# EasyEDA schematic schematic.json
TITLE: Sheet_1; REV: 1.0; Date: 2024-03-19; Sheet: 1/1; Drawn By: znegin20; Company: Your Company
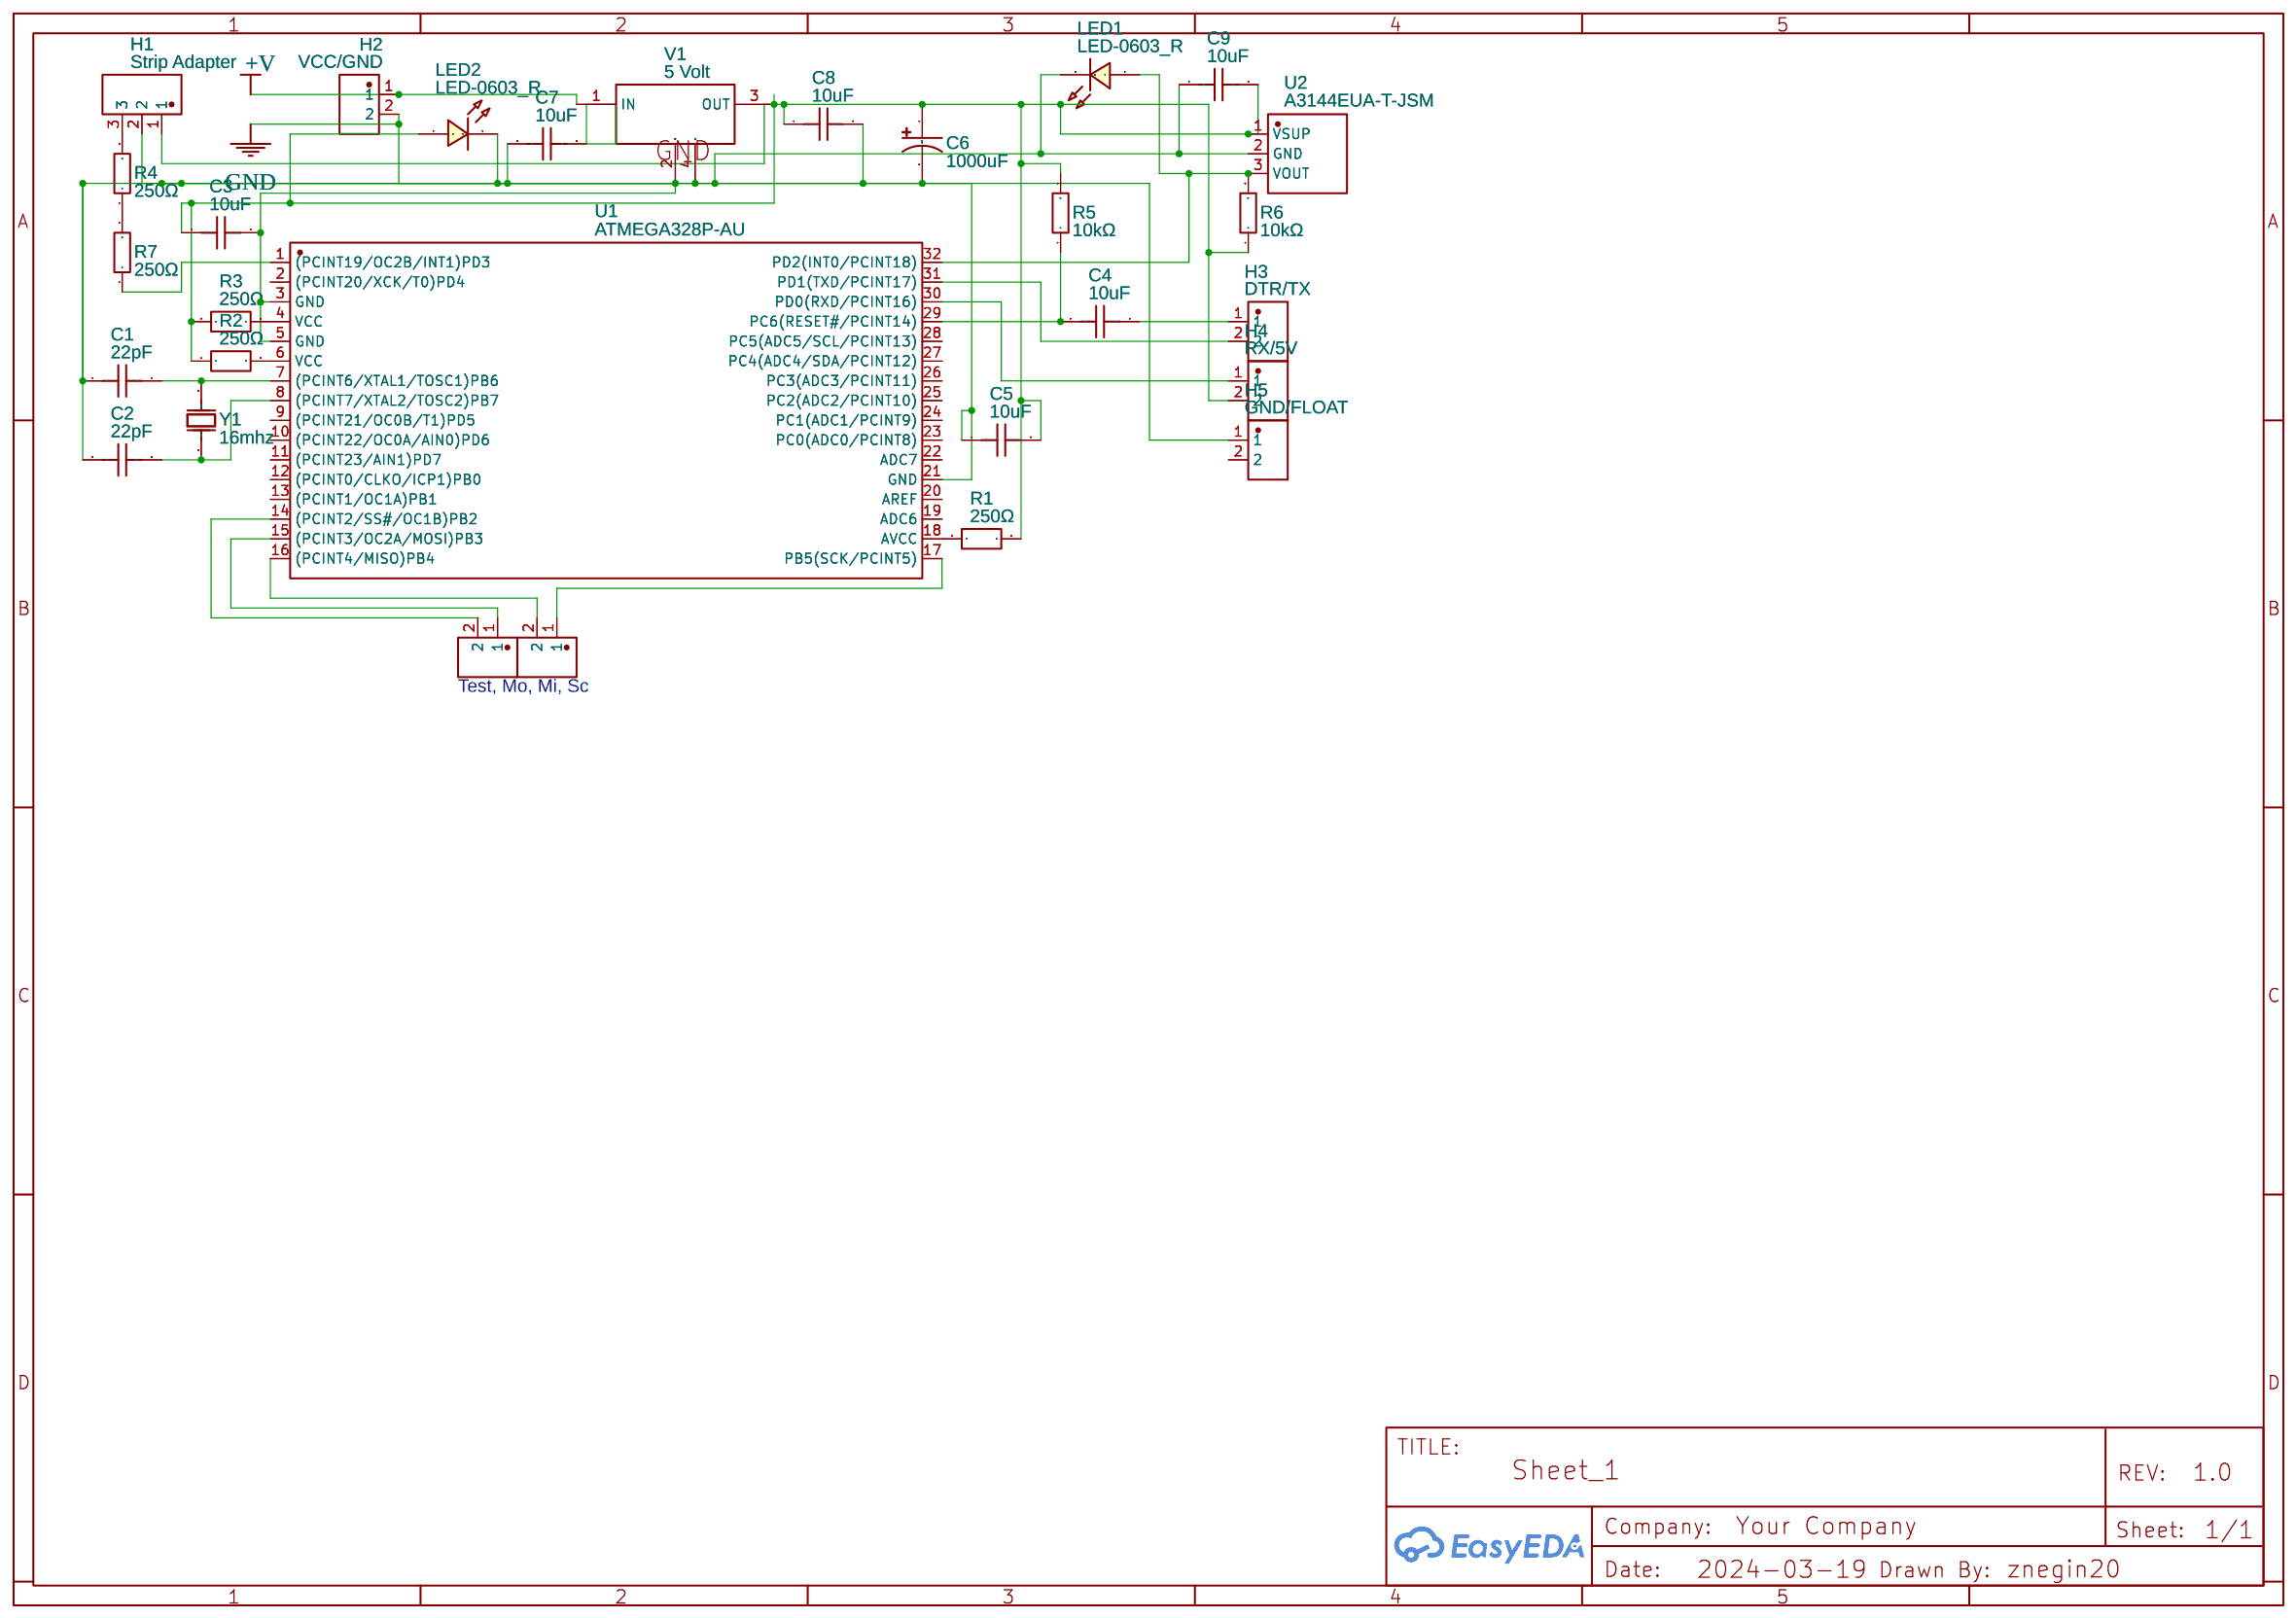
[diagram p0: schematic sheet]

## Parts
C1  22pF  [C0402]
C2  22pF  [C0402]
C3  10uF  [C0603]
C4  10uF  [C0603]
C5  10uF  [C0603]
C6  1000uF  [CAP-SMD_BD10.0-L10.3-W10.3-LS11.3-FD]
C7  10uF  [C0603]
C8  10uF  [C0603]
C9  10uF  [C0603]
H1  Strip Adapter  [HDR-TH_3P-P2.54_CS-1165SDIG]
H2  VCC/GND  [HDR-TH_2P-P2.00-H-F-W5.6-N]
H3  DTR/TX  [HDR-TH_2P-P2.00-H-F-W5.6-N]
H4  RX/5V  [HDR-TH_2P-P2.00-H-F-W5.6-N]
H5  GND/FLOAT  [HDR-TH_2P-P2.00-H-F-W5.6-N]
H7  GND/FLOAT  [HDR-TH_2P-P2.00-H-F-W5.6-N]
H8  GND/FLOAT  [HDR-TH_2P-P2.00-H-F-W5.6-N]
LED1  LED-0603_R  [LED0603_RED]
LED2  LED-0603_R  [LED0603_RED]
R1  250Ω  [R0603]
R2  250Ω  [R0603]
R3  250Ω  [R0603]
R4  250Ω  [R0402]
R5  10kΩ  [R0603]
R6  10kΩ  [R0603]
R7  250Ω  [R0402]
U1  ATMEGA328P-AU  [TQFP-32_L7.0-W7.0-P0.80-LS9.0-BL]
U2  A3144EUA-T-JSM  [TO-92S-3_L4.1-W1.7-P1.27-L]
V1  5 Volt  [TO-263-3_L10.2-W8.6-P2.54-LS14.4-TL]
Y1  16mhz  [HC-49S_L11.4-W4.5-LS12.7]

## Library data of the parts
C1 C2 = CL05C220JB5NNNC: Supplier: LCSC; Manufacturer: SAMSUNG(三星); Supplier Part: C70464; JLCPCB Part Class: Extended Part
C3-C5 C7-C9 = CL10A106MA8NRNC: Supplier: LCSC; Manufacturer: SAMSUNG(三星); Supplier Part: C96446; JLCPCB Part Class: Basic Part
C6 = VT1C102M1010: Contributor: LCSC; Supplier: LCSC; Supplier Part: C310843; Manufacturer: ROQANG(容强); JLCPCB Part Class: Extended Part
H1 = CS-1165SDIG-1*3: Contributor: LCSC; Supplier: LCSC; Supplier Part: C2886705; Manufacturer: CST(永丰盈); JLCPCB Part Class: Extended Part
H2-H5 H7 H8 = PM200-1-02-W-4.3: Contributor: LCSC; Supplier: LCSC; Supplier Part: C2906051; Manufacturer: HCTL(华灿天禄); JLCPCB Part Class: Extended Part
LED1 LED2 = LED-0603_R: Manufacturer: EVERLIGHT(台湾亿光); Manufacturer Part: 19-217/R6C-AL1M2VY/3T; Supplier Part: C72044; Supplier: LCSC; Contributor: LCEDA_01
R1-R3 = ARG03DTC2500: Contributor: lcsc; Supplier: LCSC; Supplier Part: C2828652; Manufacturer: Viking(光颉); JLCPCB Part Class: Extended Part
R4 R7 = ARG02FTC4700: Contributor: LCSC; Supplier: LCSC; Supplier Part: C284584; Manufacturer: Viking(光颉); JLCPCB Part Class: Extended Part
R5 R6 = AR03BTDX1002: Contributor: LCSC; Supplier: LCSC; Supplier Part: C319938; Manufacturer: Viking(光颉); JLCPCB Part Class: Extended Part
U1 = ATMEGA328P-AU COPY: Supplier: LCSC; Manufacturer: MICROCHIP(美国微芯); Supplier Part: C14877; JLCPCB Part Class: Extended Part
U2 = A3144EUA-T-JSM: Supplier: LCSC; Supplier Part: C18188954; Manufacturer: JSMSEMI(杰盛微); JLCPCB Part Class: Extended Part; Contributor: lcsc
V1 = LM7805SX/NOPB: Contributor: LCSC; Supplier: LCSC; Supplier Part: C2863046; Manufacturer: TI(德州仪器); JLCPCB Part Class: Extended Part
Y1 = HY16M49SSMDOB1R20: Contributor: lcsc; Supplier: LCSC; Supplier Part: C5265787; Manufacturer: Huiyuan crystal(惠源晶工)

## Nets
GND: C1.1 C2.1 C3.2 C5.1 C6.2 C7.1 C8.2 C9.1 H1.2 H2.2 H5.1 LED1.2 LED2.2 U1.3(GND) U1.5(GND) U1.21(GND) U2.2(GND) V1.2(GND) V1.4(GND)
+V: H2.1 V1.1(IN)
Net-(C1-2): C1.2 U1.7((PCINT6/XTAL1/TOSC1)PB6) Y1.2(OSC2)
Net-(C2-2): C2.2 U1.8((PCINT7/XTAL2/TOSC2)PB7) Y1.1(OSC1)
Net-(C3-1): C3.1 C5.2 C6.1 C8.1 C9.2 H1.1 H4.2 LED2.1 R1.2 R2.1 R3.1 R5.2 R6.1 U2.1(VSUP) V1.3(OUT)
Net-(C4-1): C4.1 R5.1 U1.29(PC6(RESET#/PCINT14))
Net-(C4-2): C4.2 H3.1
Net-(H1-3): H1.3 R4.2
Net-(H3-2): H3.2 U1.31(PD1(TXD/PCINT17))
Net-(H4-1): H4.1 U1.30(PD0(RXD/PCINT16))
Net-(H7-1): H7.1 U1.17(PB5(SCK/PCINT5))
Net-(H7-2): H7.2 U1.16((PCINT4/MISO)PB4)
Net-(H8-1): H8.1 U1.15((PCINT3/OC2A/MOSI)PB3)
Net-(H8-2): H8.2 U1.14((PCINT2/SS#/OC1B)PB2)
Net-(LED1-1): LED1.1 R6.2 U1.32(PD2(INT0/PCINT18)) U2.3(VOUT)
Net-(R1-1): R1.1 U1.18(AVCC)
Net-(R2-2): R2.2 U1.6(VCC)
Net-(R3-2): R3.2 U1.4(VCC)
Net-(R4-1): R4.1 R7.2
Net-(R7-1): R7.1 U1.1((PCINT19/OC2B/INT1)PD3)

Not connected (* = marked no-connect by the designer): C7 2; H5 2; U1 2((PCINT20/XCK/T0)PD4) 9((PCINT21/OC0B/T1)PD5) 10((PCINT22/OC0A/AIN0)PD6) 11((PCINT23/AIN1)PD7) 12((PCINT0/CLKO/ICP1)PB0) 13((PCINT1/OC1A)PB1) 19(ADC6) 20(AREF) 22(ADC7) 23(PC0(ADC0/PCINT8)) 24(PC1(ADC1/PCINT9)) 25(PC2(ADC2/PCINT10)) 26(PC3(ADC3/PCINT11)) 27(PC4(ADC4/SDA/PCINT12)) 28(PC5(ADC5/SCL/PCINT13))

## Notes on the sheet
- Test, Mo, Mi, Sc
